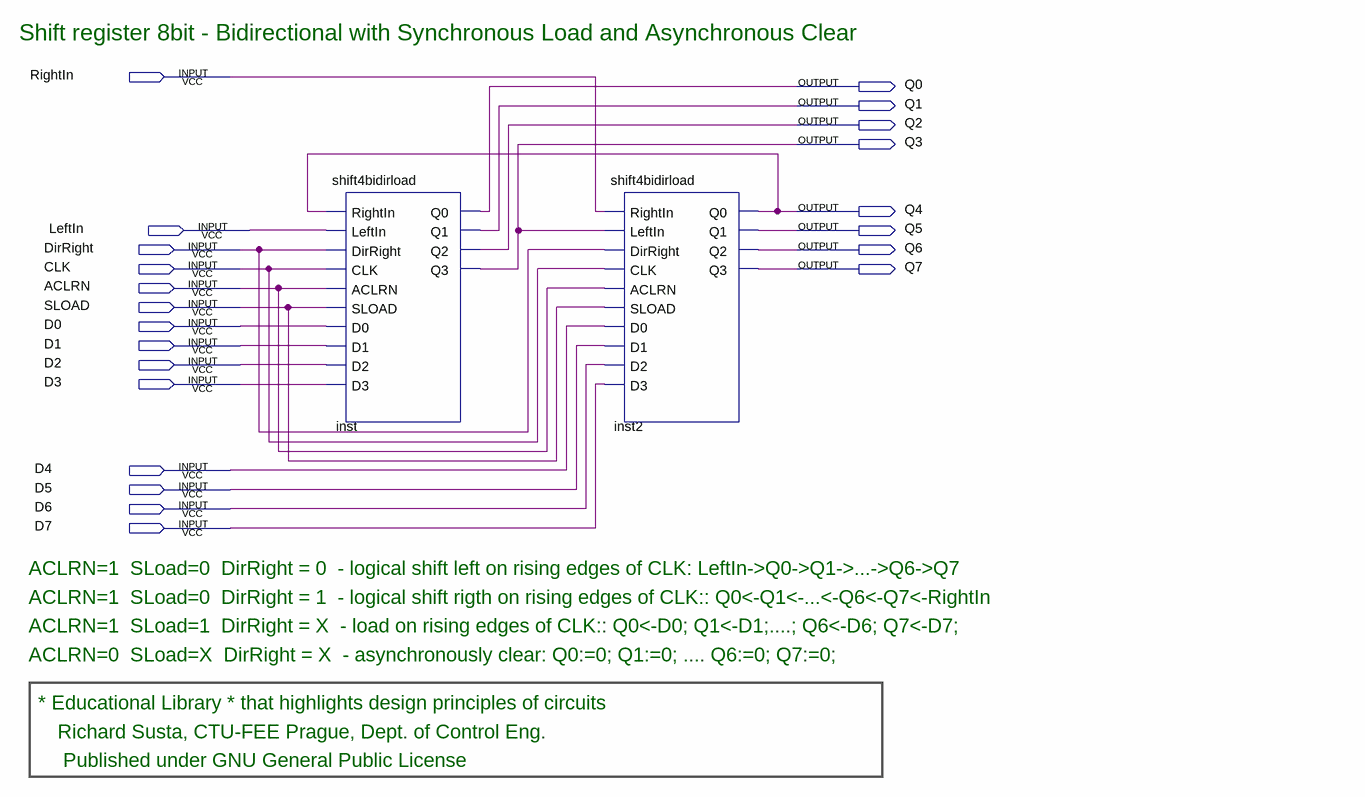
[diagram p0: schematic sheet]
// Quartus schematic shift8bidirload.bdf as structural Verilog: 2 symbols, 22 pins
module shift8bidirload (
  input  RightIn,
  input  LeftIn,
  input  DirRight,
  input  CLK,
  input  ACLRN,
  input  SLOAD,
  input  D0,
  input  D1,
  input  D2,
  input  D3,
  input  D4,
  input  D5,
  input  D6,
  input  D7,
  output Q0,
  output Q1,
  output Q2,
  output Q3,
  output Q4,
  output Q5,
  output Q6,
  output Q7
);

  shift4bidirload inst (
    .RightIn(Q4), .LeftIn(LeftIn), .DirRight(DirRight), .CLK(CLK), .ACLRN(ACLRN), .SLOAD(SLOAD), .D0(D0),
    .D1(D1), .D2(D2), .D3(D3), .Q0(Q0), .Q1(Q1), .Q2(Q2), .Q3(Q3));
  shift4bidirload inst2 (
    .RightIn(RightIn), .LeftIn(Q3), .DirRight(DirRight), .CLK(CLK), .ACLRN(ACLRN), .SLOAD(SLOAD), .D0(D4),
    .D1(D5), .D2(D6), .D3(D7), .Q0(Q4), .Q1(Q5), .Q2(Q6), .Q3(Q7));

  // Notes on the sheet:
  //   Shift register 8bit - Bidirectional with Synchronous Load and Asynchronous Clear
  //   ACLRN=1  SLoad=0  DirRight = 0  - logical shift left on rising edges of CLK: LeftIn->Q0->Q1->...->Q6->Q7
  //   ACLRN=1  SLoad=0  DirRight = 1  - logical shift rigth on rising edges of CLK:: Q0<-Q1<-...<-Q6<-Q7<-RightIn
  //   ACLRN=1  SLoad=1  DirRight = X  - load on rising edges of CLK:: Q0<-D0; Q1<-D1;....; Q6<-D6; Q7<-D7;
  //   ACLRN=0  SLoad=X  DirRight = X  - asynchronously clear: Q0:=0; Q1:=0; .... Q6:=0; Q7:=0;
  //   * Educational Library * that highlights design principles of circuits
  //   Richard Susta, CTU-FEE Prague, Dept. of Control Eng. 
  //    Published under GNU General Public License
endmodule
